# Altium schematic sheet ArduinoCustomSchematic.SchDoc
size 431 x 279 mm; SheetNumber: 1; SheetTotal: 1
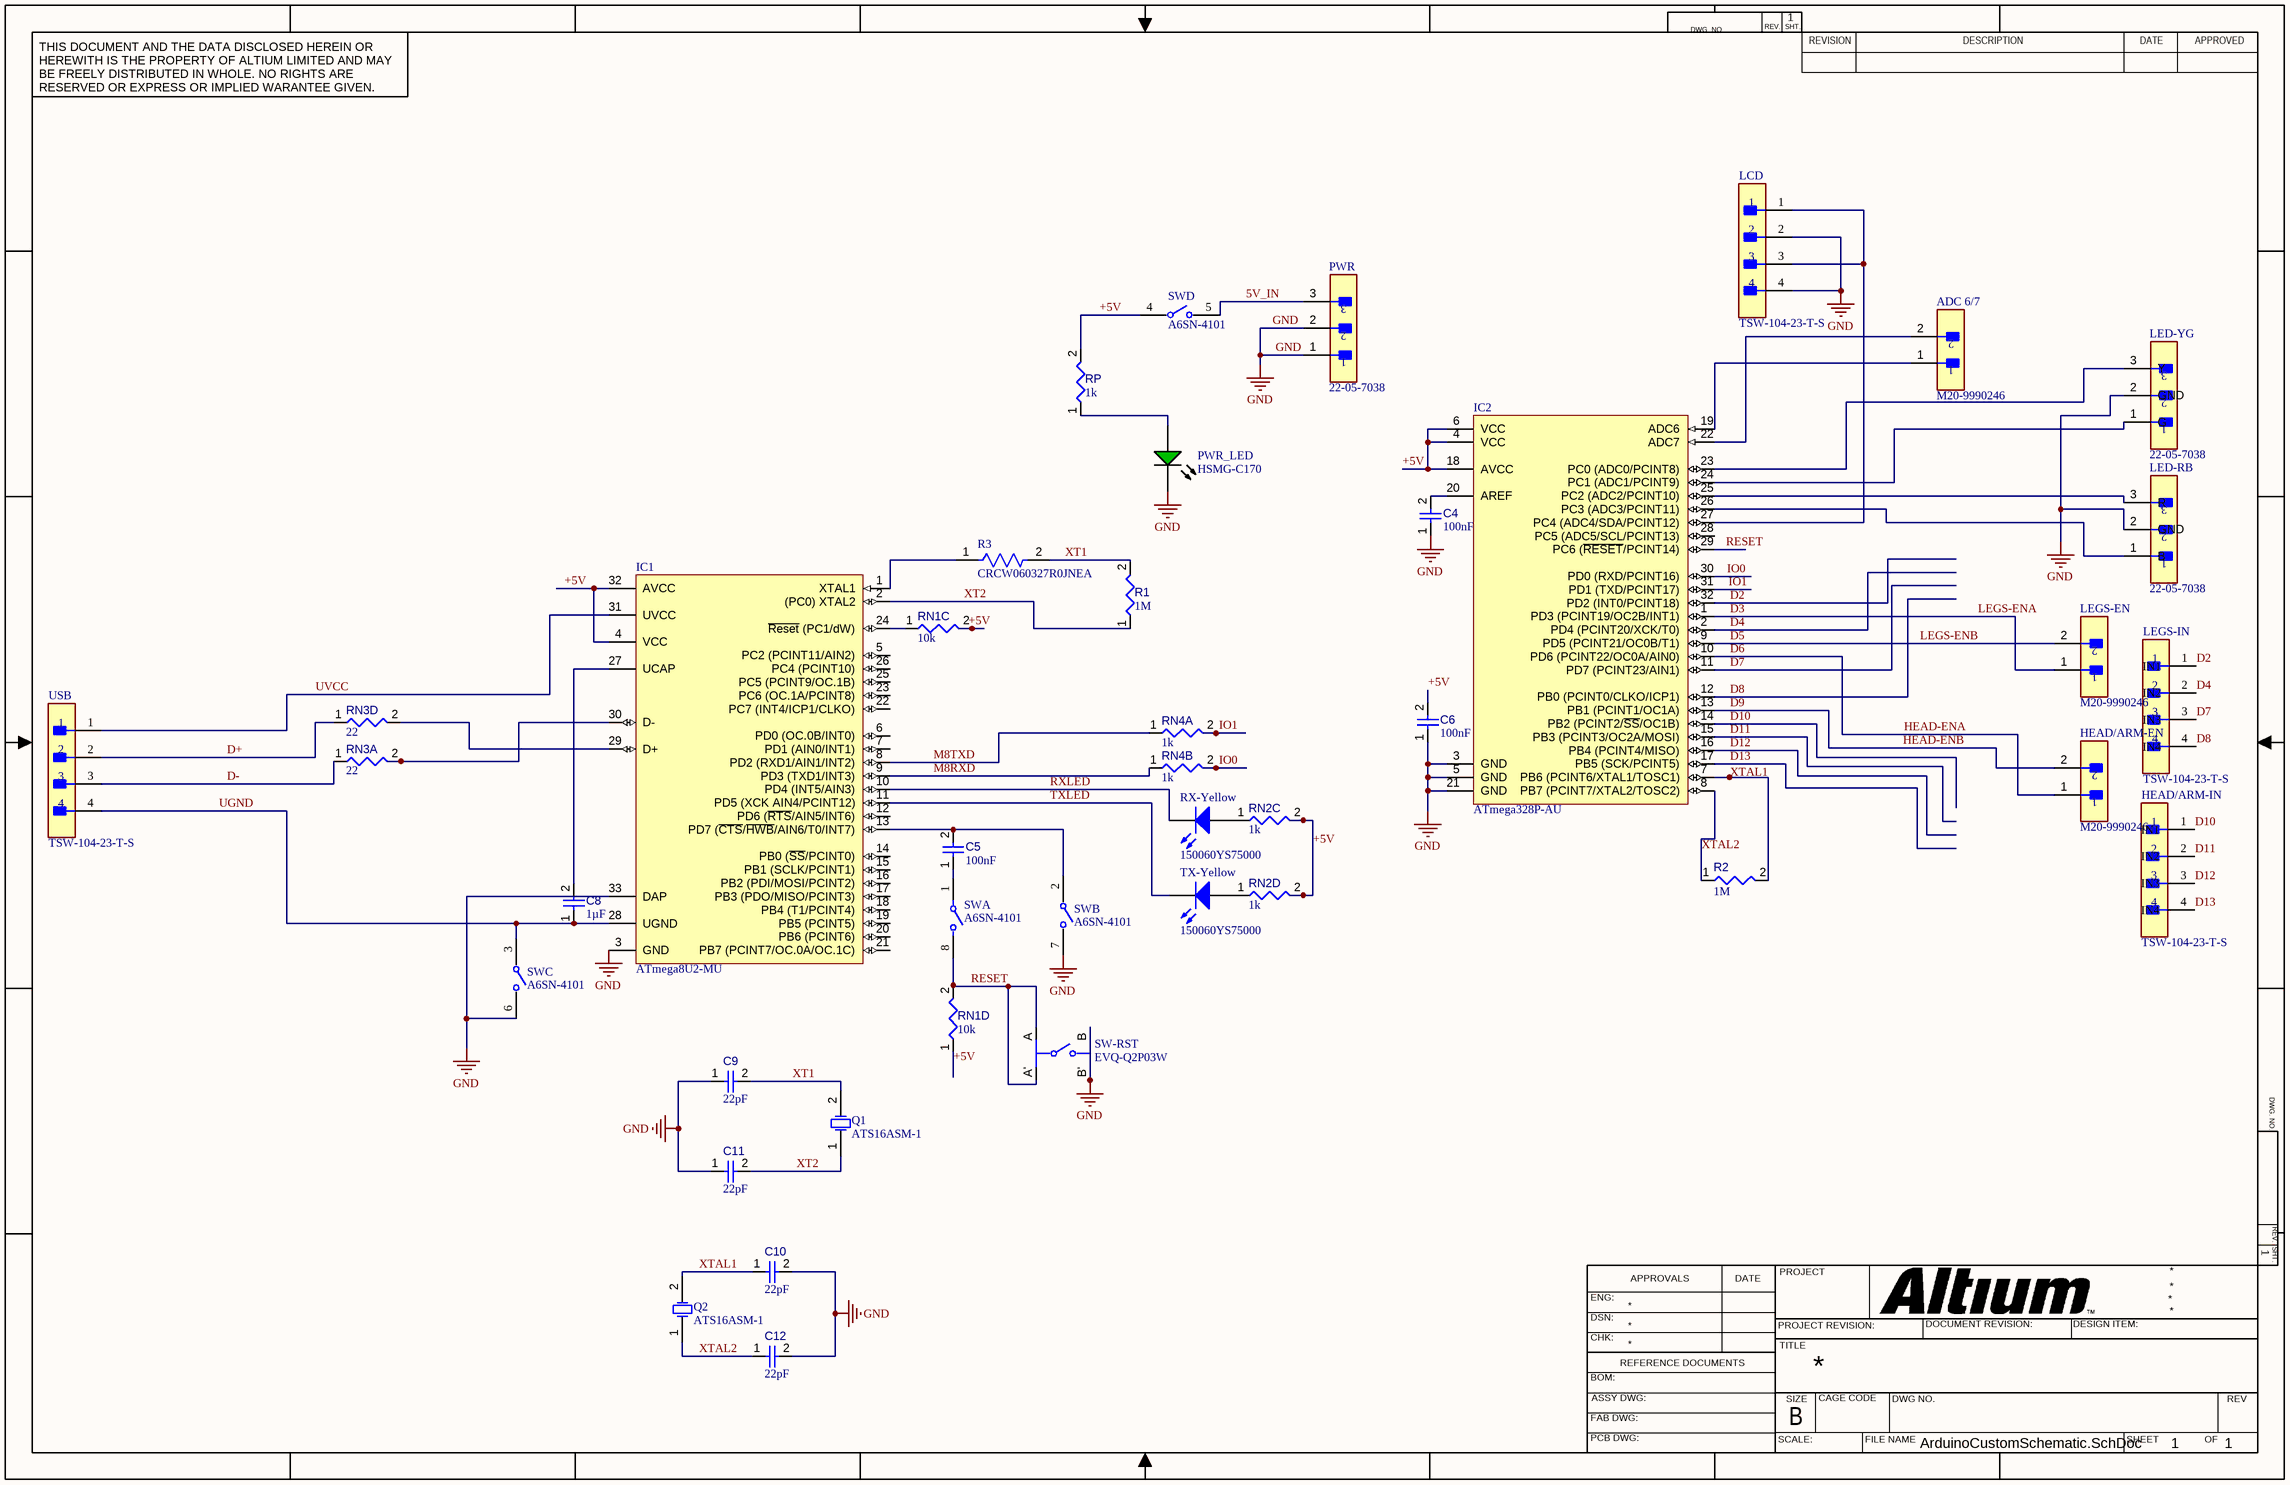
[diagram p0: ArduinoCustomSchematic.SchDoc]

## Parts
ADC_6/7  M20-9990246  [FP-M20-9990246-MFG]
C4  value 100nF  [CAPC2013X95X50LL10T25]  (hidden comment: Capacitor 100 nF +/-10% 50 V 0805)
C5  value 100nF  [CAPC2013X95X50LL10T25]  (hidden comment: Capacitor 100 nF +/-10% 50 V 0805)
C6  value 100nF  [CAPC2013X95X50LL10T25]  (hidden comment: Capacitor 100 nF +/-10% 50 V 0805)
C8  value 1µF  [CAPC1608X90X35ML15T15]  (hidden comment: Capacitor 1uF +/- 10% 16V 0603)
C9  value 22pF  [CAPC0402(1005)60_L]  (hidden comment: Capacitor 22pF +/-10% 50V 0402)
C10  value 22pF  [CAPC0402(1005)60_L]  (hidden comment: Capacitor 22pF +/-10% 50V 0402)
C11  value 22pF  [CAPC0402(1005)60_L]  (hidden comment: Capacitor 22pF +/-10% 50V 0402)
C12  value 22pF  [CAPC0402(1005)60_L]  (hidden comment: Capacitor 22pF +/-10% 50V 0402)
HEAD/ARM-EN  M20-9990246  [FP-M20-9990246-MFG]
HEAD/ARM-IN  TSW-104-23-T-S  [FP-TSW-104-23-T-S-MFG]
IC1  ATmega8U2-MU  [32PG_M]
IC2  ATmega328P-AU  [32A_M]
LCD  TSW-104-23-T-S  [FP-TSW-104-23-T-S-MFG]
LED-RB  22-05-7038  [FP-22-05-7038-MFG]
LED-YG  22-05-7038  [FP-22-05-7038-MFG]
LEGS-EN  M20-9990246  [FP-M20-9990246-MFG]
LEGS-IN  TSW-104-23-T-S  [FP-TSW-104-23-T-S-MFG]
PWR  22-05-7038  [FP-22-05-7038-MFG]
PWR_LED  HSMG-C170  [AVAG-HSMX-C170_V]
Q1  ATS16ASM-1  [CTS-ATS-SM-XTAL-2]
Q2  ATS16ASM-1  [CTS-ATS-SM-XTAL-2]
R1  value 1M  [RESC0402(1005)_L]  (hidden comment: Resistor 1M +/-5 % 0402 63 mW)
R2  value 1M  [RESC0402(1005)_L]  (hidden comment: Resistor 1M +/-5 % 0402 63 mW)
R3  CRCW060327R0JNEA  [FP-CRCW0603-e3-IPC_B]
RN1C  value 10k  [RESC0402(1005)_L]  (hidden comment: Resistor 10K  +/-1 % 0402 63 mW)
RN1D  value 10k  [RESC0402(1005)_L]  (hidden comment: Resistor 10K  +/-1 % 0402 63 mW)
RN2C  value 1k  [RESC0402(1005)_L]  (hidden comment: Resistor 1K +/-5 % 0402 63 mW)
RN2D  value 1k  [RESC0402(1005)_L]  (hidden comment: Resistor 1K +/-5 % 0402 63 mW)
RN3A  value 22  [RESC0402(1005)_L]  (hidden comment: Resistor 22R  +/-5 % 0402 63 mW)
RN3D  value 22  [RESC0402(1005)_L]  (hidden comment: Resistor 22R  +/-5 % 0402 63 mW)
RN4A  value 1k  [RESC0402(1005)_L]  (hidden comment: Resistor 1K +/-5 % 0402 63 mW)
RN4B  value 1k  [RESC0402(1005)_L]  (hidden comment: Resistor 1K +/-5 % 0402 63 mW)
RP  value 1k  [RESC0805(2012)_L]  (hidden comment: Resistor 1K +/-5% 0805 125 mW)
RX-Yellow  150060YS75000  [0603_A]
SW  A6SN-4101  [FP-A6SN-4101-MFG]  (parts A,B,C,D of 4)
SW-RST  EVQ-Q2P03W  [FP-EVQ-Q2P03W-MFG]
TX-Yellow  150060YS75000  [0603_A]
USB  TSW-104-23-T-S  [FP-TSW-104-23-T-S-MFG]

## Nets
GND: C4.1 C6.1 C9.1 C10.2 C11.1 C12.2 IC1.3(GND) IC1.33(DAP) IC2.3(GND) IC2.5(GND) IC2.21(GND) LCD.2 LCD.4 LED-RB.2(GND) LED-YG.2(GND) PWR.1 PWR.2 PWR_LED.2(K) SW.6 SW.7 SW-RST.B SW-RST.B'
5V_IN: PWR.3 SW.5
+5V: C6.2 IC1.4(VCC) IC1.32(AVCC) IC2.4(VCC) IC2.6(VCC) IC2.18(AVCC) RN1C.2 RN1D.1 RN2C.2 RN2D.2 RP.2 SW.4
D2: IC2.32(PD2_(INT0/PCINT18)) LEGS-IN.1(IN1)
D3: IC2.1(PD3_(PCINT19/OC2B/INT1)) LEGS-EN.1  [also labelled LEGS-ENA]
D4: IC2.2(PD4_(PCINT20/XCK/T0)) LEGS-IN.2(IN2)
D5: IC2.9(PD5_(PCINT21/OC0B/T1)) LEGS-EN.2  [also labelled LEGS-ENB]
D6: HEAD/ARM-EN.1 IC2.10(PD6_(PCINT22/OC0A/AIN0))  [also labelled HEAD-ENA]
D7: IC2.11(PD7_(PCINT23/AIN1)) LEGS-IN.3(IN3)
D8: IC2.12(PB0_(PCINT0/CLKO/ICP1)) LEGS-IN.4(IN4)
D9: HEAD/ARM-EN.2 IC2.13(PB1_(PCINT1/OC1A))  [also labelled HEAD-ENB]
D10: HEAD/ARM-IN.1(IN1) IC2.14(PB2_(PCINT2/~{SS}/OC1B))
D11: HEAD/ARM-IN.2(IN2) IC2.15(PB3_(PCINT3/OC2A/MOSI))
D12: HEAD/ARM-IN.3(IN3) IC2.16(PB4_(PCINT4/MISO))
D13: HEAD/ARM-IN.4(IN4) IC2.17(PB5_(SCK/PCINT5))
D+: RN3D.1 USB.2(D+)
D-: RN3A.1 USB.3(D-)
IO0: IC2.30(PD0_(RXD/PCINT16)) RN4B.2
IO1: IC2.31(PD1_(TXD/PCINT17)) RN4A.2
M8RXD: IC1.9(PD3_(TXD1/INT3)) RN4B.1
M8TXD: IC1.8(PD2_(RXD1/AIN1/INT2)) RN4A.1
RESET: IC2.29(PC6_(~{RESET}/PCINT14)) RN1D.2 SW.8 SW-RST.A SW-RST.A'
RXLED: IC1.10(PD4_(INT5/AIN3)) RX-Yellow.1(K)
TXLED: IC1.11(PD5_(XCK_AIN4/PCINT12)) TX-Yellow.1(K)
UGND: C8.1 IC1.28(UGND) SW.3 USB.4(GND)
UVCC: IC1.31(UVCC) USB.1(UVCC)
XT1: C9.2 Q1.2(X2) R1.2 R3.2
XT2: C11.2 IC1.2((PC0)_XTAL2) Q1.1(X1) R1.1
XTAL1: C10.1 IC2.7(PB6_(PCINT6/XTAL1/TOSC1)) Q2.2(X2) R2.2
XTAL2: C12.1 IC2.8(PB7_(PCINT7/XTAL2/TOSC2)) Q2.1(X1) R2.1
NetADC_6/7_1: ADC_6/7.1 IC2.19(ADC6)
NetADC_6/7_2: ADC_6/7.2 IC2.22(ADC7)
NetC4_2: C4.2 IC2.20(AREF)
NetC5_1: C5.1 SW.1
NetC5_2: C5.2 IC1.13(PD7_(~{CTS}/~{HWB}/AIN6/T0/INT7)) SW.2
NetC8_2: C8.2 IC1.27(UCAP)
NetIC1_1: IC1.1(XTAL1) R3.1
NetIC1_24: IC1.24(~{Reset}_(PC1/dW)) RN1C.1
NetIC1_29: IC1.29(D+) RN3D.2
NetIC1_30: IC1.30(D-) RN3A.2
NetIC2_23: IC2.23(PC0_(ADC0/PCINT8)) LED-YG.3(Y)
NetIC2_24: IC2.24(PC1_(ADC1/PCINT9)) LED-YG.1(G)
NetIC2_25: IC2.25(PC2_(ADC2/PCINT10)) LED-RB.3(R)
NetIC2_26: IC2.26(PC3_(ADC3/PCINT11)) LED-RB.1(B)
NetIC2_27: IC2.27(PC4_(ADC4/SDA/PCINT12)) LCD.1 LCD.3
NetPWR_LED_1: PWR_LED.1(A) RP.1
NetRN2C_1: RN2C.1 RX-Yellow.2(A)
NetRN2D_1: RN2D.1 TX-Yellow.2(A)

Not connected (* = marked no-connect by the designer): IC1 5(PC2_(PCINT11/AIN2)) 6(PD0_(OC.0B/INT0)) 7(PD1_(AIN0/INT1)) 12(PD6_(~{RTS}/AIN5/INT6)) 14(PB0_(~{SS}/PCINT0)) 15(PB1_(SCLK/PCINT1)) 16(PB2_(PDI/MOSI/PCINT2)) 17(PB3_(PDO/MISO/PCINT3)) 18(PB4_(T1/PCINT4)) 19(PB5_(PCINT5)) 20(PB6_(PCINT6)) 21(PB7_(PCINT7/OC.0A/OC.1C)) 22(PC7_(INT4/ICP1/CLKO)) 23(PC6_(OC.1A/PCINT8)) 25(PC5_(PCINT9/OC.1B)) 26(PC4_(PCINT10)); IC2 28(PC5_(ADC5/SCL/PCINT13))

## Notes on the sheet
- DWG. NO.
- REV.
- SHT.
- THIS DOCUMENT AND THE DATA DISCLOSED HEREIN OR HEREWITH IS THE PROPERTY OF ALTIUM LIMITED AND MAY BE FREELY DISTRIBUTED IN WHOLE. NO RIGHTS ARE RESERVED OR EXPRESS OR IMPLIED WARANTEE GIVEN.
- REVISION
- DESCRIPTION
- DATE
- APPROVED
- ENG:
- APPROVALS
- PROJECT
- DSN:
- CHK:
- REFERENCE DOCUMENTS
- PROJECT REVISION:
- TITLE
- DOCUMENT REVISION:
- DESIGN ITEM:
- BOM:
- FAB DWG:
- PCB DWG:
- ASSY DWG:
- SCALE:
- SIZE
- B
- CAGE CODE
- FILE NAME
- DWG NO.
- SHEET
- OF
- REV

## Library data of the parts
ADC_6/7 HEAD/ARM-EN LEGS-EN = CMP-15831-000009-1: CONN HEADER VERT 2POS 2.54MM; Manufacturer: Harwin; Conn Gender: Male; Conn Orientation: Vertical; Number Of Contacts: 2; Current Rating: 3A; ComponentLink2URL: https://cdn.harwin.com/pdfs/M20-999.pdf; ComponentLink2Description: Datasheet; Package: M20-9990246; Temperature: -40°C to +105°C; Octopart: https://octopart.com/m20-9990246-harwin-2590635; Mouser Description: 2.54mm (0.1") Pitch SIL Vertical PC Tail Pin Header, 6.1mm mating pin height, tin, 2 contacts; Temperature Range High: +105°C; Device Class L1: Connectors; RoHS: TRUE; Automotive: No; Height: 8.99mm; Number Of Rows: 1; Contact Material: Tin,Nickel; Category: Conn; Pitch: 2.54mm; Lead Free: Yes; Digikey Description: CONN HEADER VERT 2POS 2.54MM; Manufacturer Part Number: M20-9990246; Temperature Range Low: -40°C; Device Class L3: unset; Device Class L2: Headers and Wire Housings
C4-C6 = CMP-001-00018-6: Chip Capacitor, 100 nF, +/- 10%, 50 V, 0805 (2012 Metric); Capacitor Type: Ceramic; Voltage Rating: 50V; Pins: 2; Max Operating Temperature: 125°C; Min Operating Temperature: -55°C; Mounting Technology: SM; Case/Package: 0805; RoHS Compliant: True; Tolerance: 10%
C8 = CMP-001-00004-6: Chip Capacitor, 1 uF, +/- 10%, 16 V, 0603 (1608 Metric); Capacitor Type: Ceramic; Mounting Technology: SM; RoHS Compliant: True; Min Operating Temperature: -55°C; Case/Package: 0603; Pins: 2; Voltage Rating: 16V; Max Operating Temperature: 125°C; Tolerance: 10%
C9-C12 = CMP-001-00073-3: Chip Capacitor, 22pF +/-10%, 50V, 0402, Thickness 0.6 mm; Tolerance: 10%; Pins: 2; Voltage Rating: 50V; Max Operating Temperature: 85°C; Min Operating Temperature: -55°C; Mounting Technology: SMT; Case/Package: 0402
HEAD/ARM-IN LCD LEGS-IN USB = CMP-02766-001388-1: CONN HEADER VERT 4POS 2.54MM; Number of Contacts: 4; Gender: Male; Connector Type: Male Pin; Max Voltage Rating (AC): 550V; Max Current Rating: 7.6A; Radiation Hardening: No; Lead Free: Lead Free; RoHS Compliant: Yes; Contact Material: Bronze; Number of Positions: 4; Housing Color: Black; Min Operating Temperature: -55°C; Mount: Through Hole; Number of Rows: 1; Orientation: Straight; Contact Mating Length: 0.23inch; Contact Type: Male Pin; REACH SVHC: No SVHC; Max Operating Temperature: 105°C; Color: Black; Pitch: 2.54mm; Length: 10.16mm; Series: TSW; Packaging: Bulk; Contact Plating: Tin; Package Quantity: 1; Termination: Solder; Housing Material: Polyester; Width: 2.54mm; Depth: 2.54mm
IC1 = CMP-0095-00113-3: 8-bit AVR Microcontroller, 2.7-5.5V, 8KB Flash, 512 Bytes EEPROM, 512 Bytes SRAM, 32-pin VQFN, Industrial Grade (-40°C to 85°C); PackageReference: 32PG; RevisionNote: Schematic symbol corrected; DatasheetVersion: revD, Nov-2010; PackageVersion: revA, Oct-2008; PackageDescription: 32-Pin Quad Flat No-Lead (QFN) Sawn,  5 x 5 x 1.0 mm Body, Pitch 0.50 mm, 3.60mm Exposed Pad; ComponentLink1Description: Manufacturer URL; Code_JEDEC: MO-220WHHD-2; ComponentLink1URL: http://www.atmel.com/; PartNumber: ATmega8U2-MU; ComponentLink2Description: ATmega8U2/16U2/32U2 Datasheet; ComponentLink2URL: http://www.atmel.com/dyn/resources/prod_documents/doc7799.pdf; ComponentLink3Description: ATmega8U2/16U2/32U2 Summary; ComponentLink3URL: http://www.atmel.com/dyn/resources/prod_documents/7799S.pdf
IC2 = CMP-0095-00269-2: 8-bit AVR Microcontroller, 32KB Flash, 1KB EEPROM, 2KB SRAM, 32-pin TQFP, Industrial Grade (-40°C to 85°C); PackageDescription: 32-Lead, 7x7x1.0 mm Body, 0.8mm Lead Pitch, Thin Profile Plastic Quad Flat Package (TQFP); DatasheetVersion: revD, May-2011; RevisionNote: DatasheetVersion & PackageVersion updated. URLs added.; ComponentLink1URL: http://www.atmel.com/; ComponentLink2Description: ATmega48A/48PA/88A/88PA/168A/168PA/328/328P Datasheet; Code_JEDEC: MS-026-ABA; ComponentLink1Description: Manufacturer URL; PackageReference: 32A; ComponentLink3Description: ATmega48A/48PA/88A/88PA/168A/168PA/328/328P Summary; ComponentLink2URL: http://www.atmel.com/dyn/resources/prod_documents/doc8271.pdf; PackageVersion: revC, Oct-2010; ComponentLink3URL: http://www.atmel.com/dyn/resources/prod_documents/8271S.pdf
LED-RB LED-YG PWR = CMP-04776-000076-1: CONN HEADER R/A 3POS 2.54MM; Manufacturer: Molex; Number Of Contacts: 3; Conn Gender: Male; Current Rating: 4A; Voltage Rating: 500V; Conn Orientation: Right Angle; Mouser Description: 2.54mm (.100") Pitch KK® Wire-to-Board Header, Right Angle, with Friction Lock, 3 Circuits; Automotive: No; RoHS: TRUE; Octopart: https://octopart.com/22-05-7038-molex-773563; Footprint Url: https://www.molex.com/pdm_docs/sd/022057038_sd.pdf; ComponentLink2URL: https://www.molex.com/webdocs/datasheets/pdf/en-us/0022057038_PCB_HEADERS.pdf; Height: 6.05mm; ComponentLink2Description: Datasheet; Contact Material: Tin,Nickel; Device Class L2: Headers and Wire Housings; Category: Conn; Temperature Range Low: -40°C; Device Class L1: Connectors; Package: 0; Manufacturer Part Number: 22-05-7038; Lead Free: Yes; Digikey Description: CONN HEADER R/A 3POS 2.54MM; Number Of Rows: 1; Temperature Range High: +105°C; Device Class L3: unset; Pitch: 2.54mm; Temperature: -40°C to +105°C
PWR_LED = CMP-2000-05062-1: Chip LED, Green, 2.2 V, -40 to 85 degC, 2-Pin SMD, Pb-Free, Tape and Reel; Manufacturer: Avago; No. of Pins: 2; Peak Wavelength: 570nm; SVHC: NoSVHC(16-Jun-2014); Dominant Wavelength: 572nm; Forward Current If: 20mA; Viewing Angle: 170deg; Lens Shape: Rectangular; PIV Max: 5V; External Width: 1.25mm; LED Type: Standard; External Depth: 0.8mm; Opto Mounting Orientation: Top; Luminous Intensity: 15mcd; Luminous Intensity Min: 4mcd; Forward Voltage VF Max: 2.6V; External Length / Height: 2mm; Bulb Size: 1.25mmx1.4mm; Light Area Height: 1mm; Voltage Vf Typ: 2.2V; Operating Temperature Max: 85degC; Datasheet Version: Oct-08; MSL: MSL2A-4weeks; Peak Forward Current: 20mA; Package Description: 2-Pin Surface Mount Device, Body 2 x 1.25 mm, Height 0.8 mm; Datasheet URL: https://datasheet.ciiva.com/29280/180495-da-01-en-chip-led-hsmg-c170-gelb-gruen-29280971.pdf; Storage Temperature Min: -40degC; LED Colour: Green; Wavelength Typ: 570nm; Mounting Type: SMD; Forward Current If Max: 20mA; Dominant Wavelength Typ: 572nm; LED Mounting: SMD; Operating Temperature Range: -30degCto+85degC; Operating Temperature Min: -30degC; Manufacturer URL: http://www.avagotech.com/; Packaging: CutTape; Luminous Intensity Typ: 15mcd; Package Reference: HSMX-C170; Storage Temperature Max: 85degC; Opto Case Style: SMD; Forward Voltage: 2.2V
Q1 Q2 = CMP-0585-00002-2: ATS-SM Series Quartz Crystal, 16 MHz, -20 to 70 degC, 11.1 x 4.83 x 4.3mm SMD, RoHS, Tape and Reel; Manufacturer: CTS Corporation; Shunt Capacitance (C0): 7.0 pF Max; Frequency: 16 MHz; Oscillation Mode: Fundamental or 3rd Overtone; Crystal Cut: AT-Cut; ESR Maximum: 40 Ohms; Drive Level (Type): 100 uW; PackageDescription: 2-Pin SMD, Body 11.1 x 4.83 mm, Pitch 8.5 mm; PackageReference: ATS-SM-XTAL-2; ComponentLink1URL: http://www.ctscorp.com/; PartNumber: ATS16ASM-1; RoHS: TRUE; ComponentLink1Description: Manufacturer URL; Operating Temperature: -20 to 70 degC; DatasheetVersion: Rev. K; ComponentLink2Description: Datasheet; Packing: Tape and Reel; ComponentLink2URL: http://www.ctscorp.com/components/Datasheets/008-0309-0.pdf; Mounting Technology: Surface Mount; ComponentLink3URL: http://www.ctscorp.com/components/Datasheets/008-0309-0.pdf; ComponentLink3Description: Package Specification
R1 R2 = CMP-009-00151-3: Chip Resistor, 1 MOhms, +/-5 %, 63 mW, -55 to 155 degC, 0402; Power: 63mW; Tolerance: 5%; Pins: 2; Min Operating Temperature: -55°C; Case/Package: 0402; Max Operating Temperature: 155°C
R3 = CMP-2000-03145-2: RES Thick Film, 27Ω, 5%, 0.1W, 200ppm/°C, 0603; Voltage Rating: 75V; Power Rating: 100mW; Resistance: 27R; Tolerance: 5%; Case Code (Imperial): 0603; Number of Pins: 2; Weight: 7.1E-05oz; Temperature Coefficient: 200ppm/°C; Radiation Hardening: No; Length: 1.55mm; Package Quantity: 1; Packaging: Tape and Reel; Contact Plating: Tin; Composition: Thick Film; Termination: Solder; Case Code (Metric): 1608; Max Power Dissipation: 100mW; Case/Package: 0603; Width: 0.85mm; Depth: 0.85mm; Military Standard: Not; Max Operating Temperature: 155°C; Number of Terminations: 2; Min Operating Temperature: -55°C; Height: 0.45mm; Features: Automotive AEC-Q200; Lead Free: Lead Free; Voltage Rating (DC): 75V
RN1C RN1D = CMP-009-00149-3: Chip Resistor, 10 kOhms, +/-1 %, 63 mW, -55 to 125 degC, 0402; Power: 63mW; Tolerance: 1%; Min Operating Temperature: -55°C; Case/Package: 0402; Max Operating Temperature: 155°C; Pins: 2
RN2C RN2D RN4A RN4B = CMP-009-00157-3: Chip Resistor, 1 kOhms, +/-5 %, 63 mW, -55 to 155 degC, 0402; Power: 63mW; Tolerance: 5%; Max Operating Temperature: 155°C; Min Operating Temperature: -55°C; Case/Package: 0402; Pins: 2
RN3A RN3D = CMP-009-00164-3: Chip Resistor, 22 Ohms, +/-5 %, 63 mW, -55 to 155 degC, 0402; Tolerance: 5%; Power: 63mW; Pins: 2; Min Operating Temperature: -55°C; Max Operating Temperature: 155°C; Case/Package: 0402
RP = CMP-009-00118-3: Chip Resistor, 1 kOhms, +/-5%, 125 mW, -55 to 155 degC, 0805; Tolerance: 5%; Power: 125mW; Case/Package: 0805; Pins: 2; Min Operating Temperature: -55°C; Max Operating Temperature: 155°C
RX-Yellow TX-Yellow = CMP-1426-00005-1: SMD mono-color Chip LED, WL-SMCW, Yellow; Manufacturer: Wuerth Elektronik; ComponentLink1URL: http://www.we-online.com; PartNumber: 150060YS75000; Color: Yellow; ComponentLink2Description: Datasheet; ComponentLink2URL: http://katalog.we-online.com/led/datasheet/150060YS75000.pdf; ComponentLink1Description: Manufacturer URL; PackageReference: 0603_A
SW = CMP-08827-000051-1: RESET-EN; Washable: Yes; Actuator Type: Slide (Standard); Pitch: 0.1inch; Current Rating: 25mA; Mechanical Life: 1000Cycles; Number of Positions: 4; Voltage Rating (DC): 24V; Actuator Length: 1mm; Throw Configuration: SPST; Contact Resistance: 200mR; Min Operating Temperature: -30°C; Mount: Surface Mount; RoHS Compliant: Yes; Radiation Hardening: No; Contact Material: Gold; Length: 0.476inch; Depth: 9.3mm; Width: 7.5mm; Height: 3.5mm; Series: A6SN; Contact Current Rating: 25mA; Terminal Pitch: 2.54mm; Max Operating Temperature: 85°C; Package Quantity: 35; Orientation: Straight; Number of Circuits: 4; Termination: Gull Wing; Weight: 0.55g; Max Current Rating: 25mA; Electrical Life: 1000Cycles; Max Voltage Rating (DC): 24V; Packaging: Rail/Tube
SW-RST = CMP-05618-000082-1: SWITCH TACTILE SPST-NO 0.02A 15V; Voltage Rating (AC): 250V; Operating Force: 1.6N; Actuator Length: 1.3mm; Actuator Type: Standard; Contact Current Rating: 20mA; Illumination Type: Non-Illuminated; Contact Resistance: 100mR; Actuator Color: White; Electrical Life: 1000000Cycles; Body Depth: 6mm; Switch Function: Off-Mom; Switch Travel: 0.25mm; Throw Configuration: SPST; Number of Poles: 1; Mount: Surface Mount; Case/Package: SMD/SMT; Packaging: Tape and Reel; Package Quantity: 1; Depth: 6.6mm; Max Operating Temperature: 85°C; Thickness: 1.8mm; Size: 1.8mm; Series: EVQQ2; Width: 6.5mm; Voltage Rating (DC): 15V; Termination: SMD/SMT; Length: 6mm; Lead Free: Lead Free; Orientation: Straight; Current Rating: 20mA; Max Current Rating: 20mA; Height: 3.1mm; Radiation Hardening: No; Mechanical Life: 1000000Cycles; Min Operating Temperature: -40°C; Max Voltage Rating (DC): 15V; Color: White